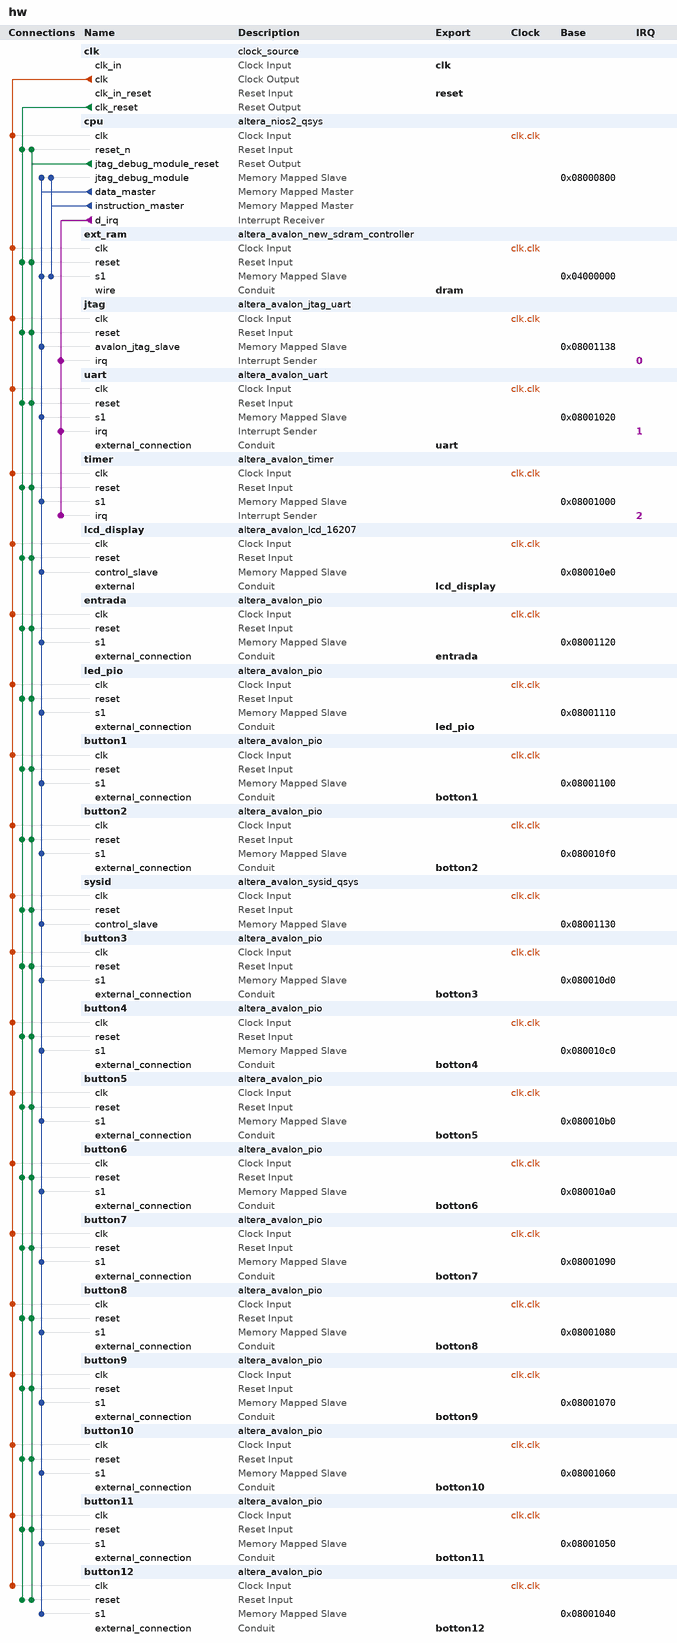
[diagram p0: system contents]
# Platform Designer (Qsys) system hw, Cyclone IV E EP4CE30F23C7
# Parameters at their usual value, and those the tool derives, are not listed.
package require -exact qsys 13.0.1.99.2
create_system hw
set_project_property DEVICE_FAMILY {Cyclone IV E}
set_project_property DEVICE EP4CE30F23C7

add_instance clk clock_source 13.0
set_instance_parameter_value clk clockFrequency 50000000

add_instance cpu altera_nios2_qsys 13.0
set_instance_parameter_value cpu resetSlave ext_ram.s1
set_instance_parameter_value cpu mmu_TLBMissExcSlave None
set_instance_parameter_value cpu exceptionSlave ext_ram.s1
set_instance_parameter_value cpu breakSlave cpu.jtag_debug_module
set_instance_parameter_value cpu impl Fast
set_instance_parameter_value cpu icache_size 4096

add_instance ext_ram altera_avalon_new_sdram_controller 13.0.1.99.2
set_instance_parameter_value ext_ram TAC 5.5
set_instance_parameter_value ext_ram TRCD 20.0
set_instance_parameter_value ext_ram TRP 20.0
set_instance_parameter_value ext_ram casLatency 3
set_instance_parameter_value ext_ram columnWidth 10
set_instance_parameter_value ext_ram dataWidth 16
set_instance_parameter_value ext_ram generateSimulationModel false
set_instance_parameter_value ext_ram model single_Micron_MT48LC4M32B2_7_chip
set_instance_parameter_value ext_ram numberOfBanks 4
set_instance_parameter_value ext_ram numberOfChipSelects 1
set_instance_parameter_value ext_ram powerUpDelay 100.0
set_instance_parameter_value ext_ram refreshPeriod 15.625
set_instance_parameter_value ext_ram rowWidth 13

add_instance jtag altera_avalon_jtag_uart 13.0.1.99.2
set_instance_parameter_value jtag simInteractiveOptions NO_INTERACTIVE_WINDOWS

add_instance uart altera_avalon_uart 13.0.1.99.2
set_instance_parameter_value uart baud 9600
set_instance_parameter_value uart dataBits 8
set_instance_parameter_value uart fixedBaud true
set_instance_parameter_value uart parity NONE
set_instance_parameter_value uart stopBits 1

add_instance timer altera_avalon_timer 13.0.1.99.2
set_instance_parameter_value timer period 1
set_instance_parameter_value timer periodUnits SEC

add_instance lcd_display altera_avalon_lcd_16207 13.0.1.99.2

add_instance entrada altera_avalon_pio 13.0.1.99.2
set_instance_parameter_value entrada direction Input
set_instance_parameter_value entrada simDoTestBenchWiring true
set_instance_parameter_value entrada width 8

add_instance led_pio altera_avalon_pio 13.0.1.99.2
set_instance_parameter_value led_pio direction Output
set_instance_parameter_value led_pio width 8

add_instance button1 altera_avalon_pio 13.0.1.99.2
set_instance_parameter_value button1 direction Input
set_instance_parameter_value button1 simDoTestBenchWiring true
set_instance_parameter_value button1 width 1

add_instance button2 altera_avalon_pio 13.0.1.99.2
set_instance_parameter_value button2 direction Input
set_instance_parameter_value button2 simDoTestBenchWiring true
set_instance_parameter_value button2 width 1

add_instance sysid altera_avalon_sysid_qsys 13.0
set_instance_parameter_value sysid id 0

add_instance button3 altera_avalon_pio 13.0.1.99.2
set_instance_parameter_value button3 direction Input
set_instance_parameter_value button3 simDoTestBenchWiring true
set_instance_parameter_value button3 width 1

add_instance button4 altera_avalon_pio 13.0.1.99.2
set_instance_parameter_value button4 direction Input
set_instance_parameter_value button4 simDoTestBenchWiring true
set_instance_parameter_value button4 width 1

add_instance button5 altera_avalon_pio 13.0.1.99.2
set_instance_parameter_value button5 direction Input
set_instance_parameter_value button5 simDoTestBenchWiring true
set_instance_parameter_value button5 width 1

add_instance button6 altera_avalon_pio 13.0.1.99.2
set_instance_parameter_value button6 direction Input
set_instance_parameter_value button6 simDoTestBenchWiring true
set_instance_parameter_value button6 width 1

add_instance button7 altera_avalon_pio 13.0.1.99.2
set_instance_parameter_value button7 direction Input
set_instance_parameter_value button7 simDoTestBenchWiring true
set_instance_parameter_value button7 width 1

add_instance button8 altera_avalon_pio 13.0.1.99.2
set_instance_parameter_value button8 direction Input
set_instance_parameter_value button8 simDoTestBenchWiring true
set_instance_parameter_value button8 width 1

add_instance button9 altera_avalon_pio 13.0.1.99.2
set_instance_parameter_value button9 direction Input
set_instance_parameter_value button9 simDoTestBenchWiring true
set_instance_parameter_value button9 width 1

add_instance button10 altera_avalon_pio 13.0.1.99.2
set_instance_parameter_value button10 direction Input
set_instance_parameter_value button10 simDoTestBenchWiring true
set_instance_parameter_value button10 width 1

add_instance button11 altera_avalon_pio 13.0.1.99.2
set_instance_parameter_value button11 direction Input
set_instance_parameter_value button11 simDoTestBenchWiring true
set_instance_parameter_value button11 width 1

add_instance button12 altera_avalon_pio 13.0.1.99.2
set_instance_parameter_value button12 direction Input
set_instance_parameter_value button12 simDoTestBenchWiring true
set_instance_parameter_value button12 width 1

# connections
add_connection clk.clk button1.clk clock
add_connection clk.clk button2.clk clock
add_connection clk.clk button3.clk clock
add_connection clk.clk button4.clk clock
add_connection clk.clk button5.clk clock
add_connection clk.clk button6.clk clock
add_connection clk.clk button7.clk clock
add_connection clk.clk button8.clk clock
add_connection clk.clk button9.clk clock
add_connection clk.clk button10.clk clock
add_connection clk.clk button11.clk clock
add_connection clk.clk button12.clk clock
add_connection clk.clk cpu.clk clock
add_connection clk.clk entrada.clk clock
add_connection clk.clk ext_ram.clk clock
add_connection clk.clk jtag.clk clock
add_connection clk.clk lcd_display.clk clock
add_connection clk.clk led_pio.clk clock
add_connection clk.clk sysid.clk clock
add_connection clk.clk timer.clk clock
add_connection clk.clk uart.clk clock
add_connection clk.clk_reset button1.reset reset
add_connection clk.clk_reset button2.reset reset
add_connection clk.clk_reset button3.reset reset
add_connection clk.clk_reset button4.reset reset
add_connection clk.clk_reset button5.reset reset
add_connection clk.clk_reset button6.reset reset
add_connection clk.clk_reset button7.reset reset
add_connection clk.clk_reset button8.reset reset
add_connection clk.clk_reset button9.reset reset
add_connection clk.clk_reset button10.reset reset
add_connection clk.clk_reset button11.reset reset
add_connection clk.clk_reset button12.reset reset
add_connection clk.clk_reset cpu.reset_n reset
add_connection clk.clk_reset entrada.reset reset
add_connection clk.clk_reset ext_ram.reset reset
add_connection clk.clk_reset jtag.reset reset
add_connection clk.clk_reset lcd_display.reset reset
add_connection clk.clk_reset led_pio.reset reset
add_connection clk.clk_reset sysid.reset reset
add_connection clk.clk_reset timer.reset reset
add_connection clk.clk_reset uart.reset reset
add_connection cpu.jtag_debug_module_reset button1.reset reset
add_connection cpu.jtag_debug_module_reset button2.reset reset
add_connection cpu.jtag_debug_module_reset button3.reset reset
add_connection cpu.jtag_debug_module_reset button4.reset reset
add_connection cpu.jtag_debug_module_reset button5.reset reset
add_connection cpu.jtag_debug_module_reset button6.reset reset
add_connection cpu.jtag_debug_module_reset button7.reset reset
add_connection cpu.jtag_debug_module_reset button8.reset reset
add_connection cpu.jtag_debug_module_reset button9.reset reset
add_connection cpu.jtag_debug_module_reset button10.reset reset
add_connection cpu.jtag_debug_module_reset button11.reset reset
add_connection cpu.jtag_debug_module_reset button12.reset reset
add_connection cpu.jtag_debug_module_reset cpu.reset_n reset
add_connection cpu.jtag_debug_module_reset entrada.reset reset
add_connection cpu.jtag_debug_module_reset ext_ram.reset reset
add_connection cpu.jtag_debug_module_reset jtag.reset reset
add_connection cpu.jtag_debug_module_reset lcd_display.reset reset
add_connection cpu.jtag_debug_module_reset led_pio.reset reset
add_connection cpu.jtag_debug_module_reset sysid.reset reset
add_connection cpu.jtag_debug_module_reset timer.reset reset
add_connection cpu.jtag_debug_module_reset uart.reset reset
add_connection cpu.data_master button1.s1 avalon
set_connection_parameter_value cpu.data_master/button1.s1 baseAddress 0x08001100
add_connection cpu.data_master button2.s1 avalon
set_connection_parameter_value cpu.data_master/button2.s1 baseAddress 0x080010f0
add_connection cpu.data_master button3.s1 avalon
set_connection_parameter_value cpu.data_master/button3.s1 baseAddress 0x080010d0
add_connection cpu.data_master button4.s1 avalon
set_connection_parameter_value cpu.data_master/button4.s1 baseAddress 0x080010c0
add_connection cpu.data_master button5.s1 avalon
set_connection_parameter_value cpu.data_master/button5.s1 baseAddress 0x080010b0
add_connection cpu.data_master button6.s1 avalon
set_connection_parameter_value cpu.data_master/button6.s1 baseAddress 0x080010a0
add_connection cpu.data_master button7.s1 avalon
set_connection_parameter_value cpu.data_master/button7.s1 baseAddress 0x08001090
add_connection cpu.data_master button8.s1 avalon
set_connection_parameter_value cpu.data_master/button8.s1 baseAddress 0x08001080
add_connection cpu.data_master button9.s1 avalon
set_connection_parameter_value cpu.data_master/button9.s1 baseAddress 0x08001070
add_connection cpu.data_master button10.s1 avalon
set_connection_parameter_value cpu.data_master/button10.s1 baseAddress 0x08001060
add_connection cpu.data_master button11.s1 avalon
set_connection_parameter_value cpu.data_master/button11.s1 baseAddress 0x08001050
add_connection cpu.data_master button12.s1 avalon
set_connection_parameter_value cpu.data_master/button12.s1 baseAddress 0x08001040
add_connection cpu.data_master cpu.jtag_debug_module avalon
set_connection_parameter_value cpu.data_master/cpu.jtag_debug_module baseAddress 0x08000800
add_connection cpu.data_master entrada.s1 avalon
set_connection_parameter_value cpu.data_master/entrada.s1 baseAddress 0x08001120
add_connection cpu.data_master ext_ram.s1 avalon
set_connection_parameter_value cpu.data_master/ext_ram.s1 baseAddress 0x04000000
add_connection cpu.data_master jtag.avalon_jtag_slave avalon
set_connection_parameter_value cpu.data_master/jtag.avalon_jtag_slave baseAddress 0x08001138
add_connection cpu.data_master lcd_display.control_slave avalon
set_connection_parameter_value cpu.data_master/lcd_display.control_slave baseAddress 0x080010e0
add_connection cpu.data_master led_pio.s1 avalon
set_connection_parameter_value cpu.data_master/led_pio.s1 baseAddress 0x08001110
add_connection cpu.data_master sysid.control_slave avalon
set_connection_parameter_value cpu.data_master/sysid.control_slave baseAddress 0x08001130
add_connection cpu.data_master timer.s1 avalon
set_connection_parameter_value cpu.data_master/timer.s1 baseAddress 0x08001000
add_connection cpu.data_master uart.s1 avalon
set_connection_parameter_value cpu.data_master/uart.s1 baseAddress 0x08001020
add_connection cpu.instruction_master cpu.jtag_debug_module avalon
set_connection_parameter_value cpu.instruction_master/cpu.jtag_debug_module baseAddress 0x08000800
add_connection cpu.instruction_master ext_ram.s1 avalon
set_connection_parameter_value cpu.instruction_master/ext_ram.s1 baseAddress 0x04000000
add_connection cpu.d_irq jtag.irq interrupt
set_connection_parameter_value cpu.d_irq/jtag.irq irqNumber 0
add_connection cpu.d_irq timer.irq interrupt
set_connection_parameter_value cpu.d_irq/timer.irq irqNumber 2
add_connection cpu.d_irq uart.irq interrupt
set_connection_parameter_value cpu.d_irq/uart.irq irqNumber 1

# exported interfaces
add_interface clk clock sink
set_interface_property clk EXPORT_OF clk.clk_in
add_interface reset reset sink
set_interface_property reset EXPORT_OF clk.clk_in_reset
add_interface dram conduit end
set_interface_property dram EXPORT_OF ext_ram.wire
add_interface uart conduit end
set_interface_property uart EXPORT_OF uart.external_connection
add_interface lcd_display conduit end
set_interface_property lcd_display EXPORT_OF lcd_display.external
add_interface led_pio conduit end
set_interface_property led_pio EXPORT_OF led_pio.external_connection
add_interface botton1 conduit end
set_interface_property botton1 EXPORT_OF button1.external_connection
add_interface botton2 conduit end
set_interface_property botton2 EXPORT_OF button2.external_connection
add_interface entrada conduit end
set_interface_property entrada EXPORT_OF entrada.external_connection
add_interface botton3 conduit end
set_interface_property botton3 EXPORT_OF button3.external_connection
add_interface botton4 conduit end
set_interface_property botton4 EXPORT_OF button4.external_connection
add_interface botton5 conduit end
set_interface_property botton5 EXPORT_OF button5.external_connection
add_interface botton6 conduit end
set_interface_property botton6 EXPORT_OF button6.external_connection
add_interface botton7 conduit end
set_interface_property botton7 EXPORT_OF button7.external_connection
add_interface botton8 conduit end
set_interface_property botton8 EXPORT_OF button8.external_connection
add_interface botton9 conduit end
set_interface_property botton9 EXPORT_OF button9.external_connection
add_interface botton10 conduit end
set_interface_property botton10 EXPORT_OF button10.external_connection
add_interface botton11 conduit end
set_interface_property botton11 EXPORT_OF button11.external_connection
add_interface botton12 conduit end
set_interface_property botton12 EXPORT_OF button12.external_connection

set_interconnect_requirement {$system} qsys_mm.clockCrossingAdapter HANDSHAKE
set_interconnect_requirement {$system} qsys_mm.maxAdditionalLatency 1

save_system hw.qsys
